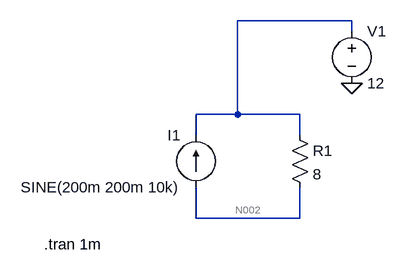
[diagram p0: schematic Draft3.asc]
Draft3.asc, the LTspice schematic file:
Version 4
SHEET 1 880 680
WIRE 352 -32 176 -32
WIRE 352 -16 352 -32
WIRE 176 112 176 -32
WIRE 176 112 112 112
WIRE 272 112 176 112
WIRE 112 144 112 112
WIRE 272 144 272 112
WIRE 112 272 112 224
WIRE 272 272 272 224
WIRE 272 272 112 272
FLAG 352 64 0
SYMBOL res 256 128 R0
SYMATTR InstName R1
SYMATTR Value 8
SYMBOL current 112 224 R180
WINDOW 0 24 80 Left 2
WINDOW 3 24 0 Left 2
WINDOW 123 0 0 Left 0
WINDOW 39 0 0 Left 0
SYMATTR InstName I1
SYMATTR Value SINE(200m 200m 10k)
SYMBOL voltage 352 -32 R0
WINDOW 123 0 0 Left 0
WINDOW 39 0 0 Left 0
SYMATTR InstName V1
SYMATTR Value 12
TEXT -122 312 Left 2 !.tran 1m

The netlist it stands for:
* Draft3.asc
R1 N001 N002 8
I1 N002 N001 SINE(200m 200m 10k)
V1 N001 0 12
.tran 1m
.backanno
.end

* Results of the author's LTspice run, read from the files saved beside the schematic
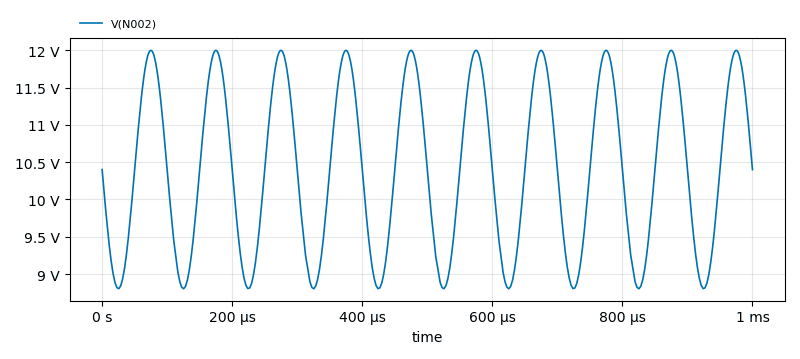
[diagram p1: Transient Analysis of Draft3.asc, plotted from the saved traces]
* Transient Analysis, 1 run:
*   V(N002): min 8.802 V, max 12 V, average 10.4 V, rms 10.46 V, last 10.4 V